# EAGLE design Tardis Lightv004 (EAGLE 6.1)
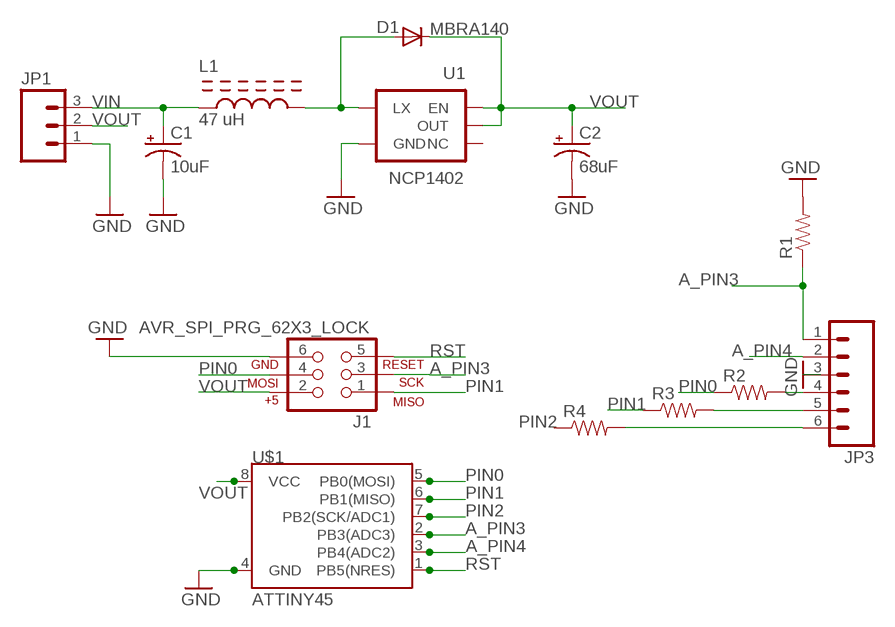
[diagram p0: schematic, sheet 1]

## Parts
C1  10uF  CAP_POL1206  [EIA3216]
C2  68uF  CAP_POL  [EIA2917]
D1  MBRA140  DIODESMA  [SMA-DIODE]
J1  AVR_SPI_PRG_62X3_LOCK  [2X3_LOCK]
JP1  M03PTH  [1X03]
JP3  M06SIP  [1X06]
L1  47 uH  SSR12606028  [NR6028]
R1  RESISTOR1206  [1206]
R2  RESISTOR1206  [1206]
R3  RESISTOR1206  [1206]
R4  RESISTOR1206  [1206]
U1  NCP1402  V_REG_NCP1400SOT23-5  [SOT23-5]
U$1  ATTINY45  [SO08-EIAJ]

## Nets
A_PIN3: J1.3 JP3.1 R1.1 U$1.2(PB3(ADC3))
A_PIN4: JP3.2 U$1.3(PB4(ADC2))
GND: C1.C(-) C2.C(-) J1.6 JP1.1 JP3.3 R1.2 U1.4(GND) U$1.4(GND)
N$1: JP3.4 R2.2
N$3: D1.A L1.P$2(P2) U1.5(LX)
N$6: JP3.5 R3.2
N$7: JP3.6 R4.2
PIN0: J1.4 R2.1 U$1.5(PB0(MOSI))
PIN1: J1.1 R3.1 U$1.6(PB1(MISO))
PIN2: R4.1 U$1.7(PB2(SCK/ADC1))
RST: J1.5 U$1.1(PB5(NRES))
VIN: C1.A(+) JP1.3 L1.P$1(P1)
VOUT: C2.A(+) D1.C J1.2 JP1.2 U1.1(EN) U1.2(OUT) U$1.8(VCC)
Unconnected: U1.3(NC)

## Library data of the parts
C1 C2 = SparkFun:CAP_POL: Capacitor Polarized These are standard SMD and PTH capacitors. Normally 10uF, 47uF, and 100uF in electrolytic and tantalum varieties. Always verify the external diameter of the through hole cap, it varies with capacity, voltage, and manufacturer. The EIA devices should be standard.
D1 = SparkFun:DIODE: Diode These are standard reverse protection diodes and small signal diodes. SMA package can handle up to about 1A. SOD-323 can handle about 200mA. What the SOD-323 package when ordering, there are some mfgs out there that are 5-pin packages.
J1 = SparkFun:AVR_SPI_PRG_6: AVR ISP 6 Pin This is the reduced ISP connector for AVR programming. Common on Arduino. This footprint will take up less PCB space and can be used with a 10-pin to 6-pin adapter such as SKU: BOB-08508
JP1 = SparkFun:M03: Header 3 Standard 3-pin 0.1" header. Use with straight break away headers (SKU : PRT-00116), right angle break away headers (PRT-00553), swiss pins (PRT-00743), machine pins (PRT-00117), and female headers (PRT-00115). Molex polarized connector foot print use with SKU : PRT-08232 with associated crimp pins and housings.
JP3 = SparkFun:M06: Header 6 Standard 6-pin 0.1" header. Use with straight break away headers (SKU : PRT-00116), right angle break away headers (PRT-00553), swiss pins (PRT-00743), machine pins (PRT-00117), and female headers (PRT-00115). Molex polarized connector foot print use with SKU : PRT-08094 with associated crimp pins and housings. NOTES ON THE VARIANTS LOCK and LOCK_LONGPADS... This footprint was designed to help hold the alignment of a through-hole component (i.e. 6-pin header) while soldering it into place. You may notice that each hole has been shifted either up or down by 0.005 of an inch from it's more standard position (which is a perfectly straight line). This slight alteration caused the pins (the squares in the middle) to touch the edges of the holes. Because they are alternating, it causes a "brace" to hold the component in place. 0.005 has proven to be the perfect amount of "off-center" position when using our standard breakaway headers. Although looks a little odd when you look at the bare footprint, once you have a header in there, the alteration is very hard to notice. Also, if you push a header all the way into place, it is covered up entirely on the bottom side. This idea of altering the position of holes to aid alignment will be further integrated into the Sparkfun Library for other footprints. It can help hold any component with 3 or more connection pins.
L1 = ieee-ucsd-lbr_inductor-bourns Roy Edit:SSR1260
R1-R4 = SparkFun:RESISTOR: Resistor Basic schematic elements and footprints for 0603, 1206, and PTH resistors.
U1 = SparkFun:V_REG_NCP1400: Switching step-up voltage regulator NCP1400 switiching regulator takes single cell AA and outputs 100mA at 3.3V or 5V with minimal number of external components.
U$1 = SparkFun:ATTINY45: Atmel ATTiny45

## Board
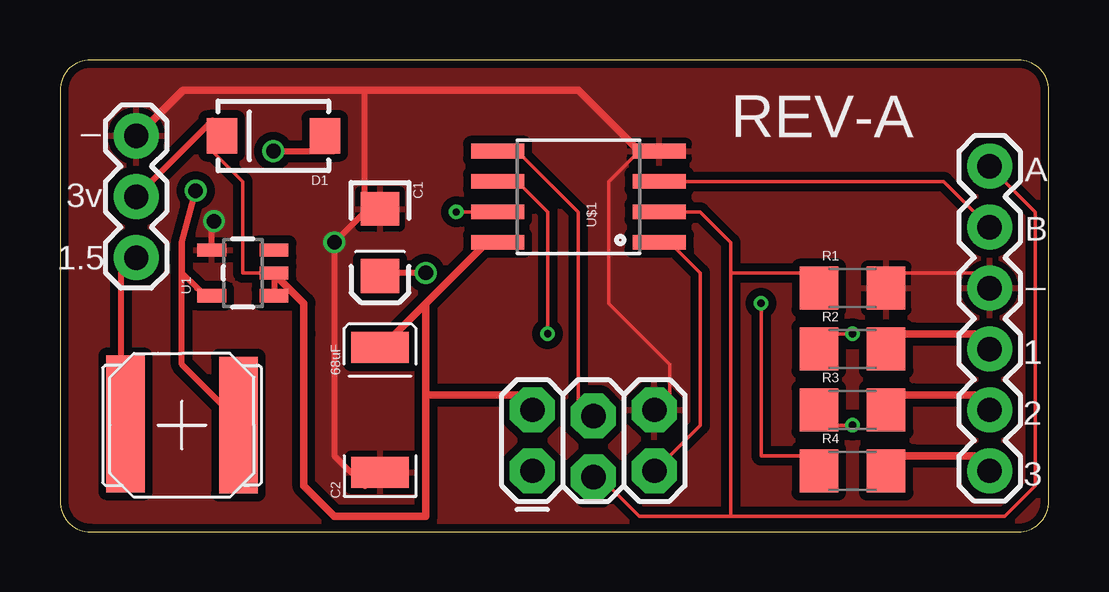
[diagram p1: board, top side]
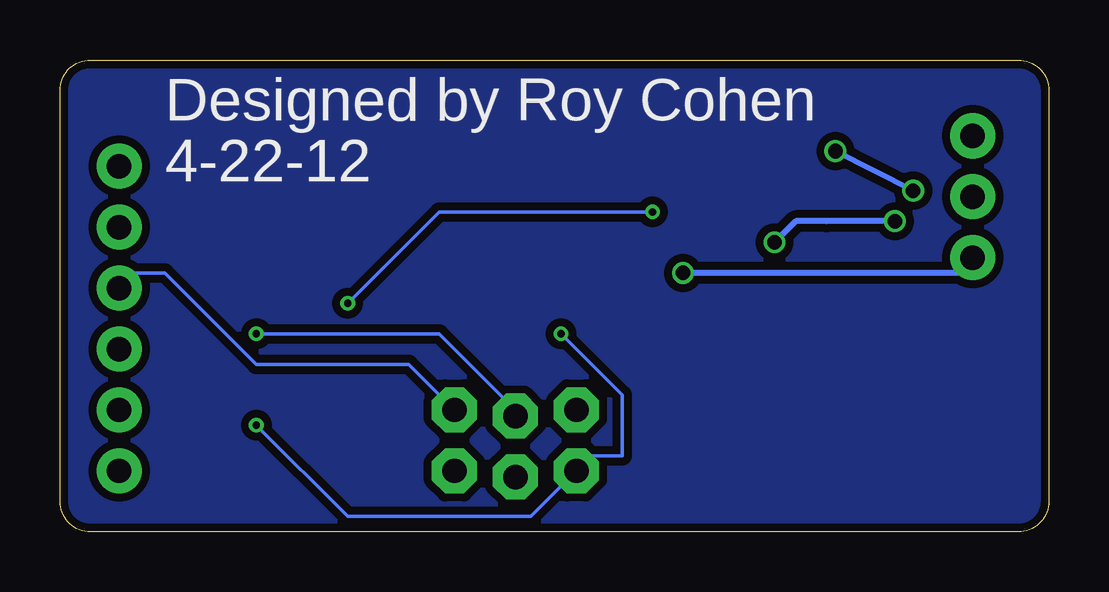
[diagram p2: board, bottom side, seen from below]

Size 41.2 x 19.68 mm. Coordinates in mm from the lower left corner, seen from the top.
Outline: 0,18.41 0,1.27 arc90 1.27,0 39.93,0 arc90 41.2,1.27 41.2,18.41 arc90 39.93,19.68 1.27,19.68 arc90 0,18.41
Copper layers (1*16): Top 0.035mm / dielectric 1.5mm / Bottom 0.035mm
Design rules: minimum track width 6mil, minimum drill 12mil, track to track 6mil, track to pad 6mil, pad to pad 6mil, via to via 6mil, smd to smd 0mil, copper to edge 10mil, drill to drill 10mil, minimum pad ring 10mil, minimum via ring 6mil, stop-mask expansion 2mil, vias tented up to drill 100mil, thermal gap 10mil

### Footprints (pad centres in the part's own frame; a part is rotated, then mirrored left to right if it is on the bottom)
EIA3216 = smd 1.4 x 1.6: A 1.4,0; C -1.4,0
EIA2917 = smd 1.3 x 2.4: A 2.6,0; C -2.6,0
SMA-DIODE = smd 1.27 x 1.47: A -2.15,0; C 2.15,0
2X3_LOCK = drill 1.016 pad 1.88 octagon: 1 0,0; 2 0,2.54; 3 2.54,-0.254; 4 2.54,2.286; 5 5.08,0; 6 5.08,2.54
1X03 = drill 1.016 pad 1.88: 1 0,0; 2 2.54,0; 3 5.08,0
1X06 = drill 1.016 pad 1.88: 1 0,0; 2 2.54,0; 3 5.08,0; 4 7.62,0; 5 10.16,0; 6 12.7,0
NR6028 = smd 5.7 x 1.6: P$1 -0.05,-2.35; P$2 0,2.35
1206 = smd 1.6 x 1.8: 1 -1.4,0; 2 1.4,0
SOT23-5 = smd 0.55 x 1.2: 1 -0.95,-1.3; 2 0,-1.3; 3 0.95,-1.3; 4 0.95,1.3; 5 -0.95,1.3
SO08-EIAJ = smd 0.61 x 2.21: 1 -1.905,-3.378; 2 -0.635,-3.378; 3 0.635,-3.378; 4 1.905,-3.378; 5 1.905,3.353; 6 0.635,3.353; 7 -0.635,3.353; 8 -1.905,3.353

### Placement (x,y rotation side)
C1  13.33,12.06 270 top
C2  13.33,5.08 90 top
D1  8.89,16.51 180 top
J1  19.68,2.54 0 top
JP1  3.17,16.51 270 top
JP3  38.74,15.24 270 top
L1  5.08,4.45 270 top
R1  33.02,10.16 0 top
R2  33.02,7.62 0 top
R3  33.02,5.08 0 top
R4  33.02,2.54 0 top
U1  7.62,10.79 90 top
U$1  21.59,13.97 90 top

### Tracks (layer width: path | path; a pad name or v marks a point on that pad's centre or on a via)
A_PIN3
  Top 0.152: 27.94,10.79 31.75,10.79 R1.1 | 27.94,10.79 27.94,12.06 26.67,13.33 25.4,13.33 U$1.2 | 27.94,0.64 24.13,0.64 22.86,1.91 J1.3 | 27.94,10.79 27.94,0.64 | 27.94,0.64 39.37,0.64 40.64,1.91 40.64,13.33 39.37,14.61 JP3.1
A_PIN4
  Top 0.152: U$1.3 25.4,14.61 36.83,14.61 38.1,13.33 JP3.2
GND  (via drill 0.6 pad 0.25)
  Top 0.152: 24.13,15.88 21.59,18.42 12.7,18.42 | 24.13,15.88 U$1.4 24.13,15.88 | R1.2 34.29,10.79 38.1,10.79 JP3.3 | 24.13,15.88 22.86,14.61 22.86,9.53 25.4,6.98 25.4,5.71 J1.6
  Top 0.254: 12.7,13.33 C1.C 12.7,13.33 | C2.C 12.7,1.91 11.43,3.17 v11.43,12.06 12.7,13.33 | 5.08,18.42 3.81,17.15 | 12.7,18.42 5.08,18.42 | 12.7,13.33 12.7,18.42 | 3.81,17.15 JP1.1 | v6.41,12.95 6.32,12.86 U1.4 | 12.7,18.42 5.08,18.42 | 5.08,18.42 3.81,17.15
  Top 0.305: 24.13,15.88 21.59,18.42 12.7,18.42 5.14,18.42 3.24,16.51
  Bottom 0.152: J1.6 25.4,5.71 26.67,6.98 33.02,6.98 36.83,10.79 38.1,10.79 JP3.3
  Bottom 0.254: v6.41,12.95 9.27,12.95 10.54,12.95 v11.43,12.06
  pour Top (isolate 0.33): 1.45,19.48 39.85,19.48 arc-90 40.92,18.42 40.92,1.17 arc-90 40.03,0.28 1.45,0.28 arc-90 0.2,1.52 0.2,18.24 arc-90
N$1
  Top 0.254: R2.2 34.29,8.26 35.56,8.26 38.1,8.26 JP3.4
  Top 0.305: JP3.4 38.1,8.26 35.56,8.26 34.93,8.26 34.86,8.19
N$3  (via drill 0.61)
  Top 0.254: v8.89,15.88 11.43,15.88 D1.A | 5.08,12.06 v5.65,14.22 | 5.08,10.79 5.08,6.98 7.62,4.45 L1.P$2 | 5.08,10.79 5.08,12.06 | 5.08,12.06 5.08,10.79 | 5.08,10.79 5.71,10.16 | 5.08,12.06 5.08,10.79 | 5.08,10.79 5.97,9.91 6.03,9.85 U1.5
  Bottom 0.254: v5.65,14.22 v8.89,15.88
N$4
  pour Bottom (isolate 0.33): 1.45,19.48 39.85,19.48 arc-90 40.92,18.42 40.92,1.17 arc-90 40.03,0.28 1.45,0.28 arc-90 0.2,1.52 0.2,18.24 arc-90
N$6
  Top 0.254: R3.2 34.29,5.71 35.05,5.71 35.56,5.71 38.1,5.71 JP3.5
  Top 0.305: 35.56,5.71 35.05,5.71 38.1,5.71 38.8,5.02
N$7
  Top 0.254: R4.2 34.29,3.17 35.12,3.17 35.56,3.17 38.1,3.17 JP3.6
  Top 0.305: 38.8,2.48 38.1,3.17 35.56,3.17 35.12,3.17
PIN0  (via drill 0.3)
  Top 0.152: v33.02,8.26 31.75,8.26 R2.1 | U$1.5 19.05,15.88 21.59,13.33 21.59,4.45 J1.4
  Bottom 0.152: v33.02,8.26 25.4,8.26 21.59,4.45 J1.4
PIN1  (via drill 0.3)
  Top 0.152: v33.02,4.45 31.75,4.45 R3.1 | v20.32,8.26 20.32,13.33 19.05,14.61 U$1.6
  Bottom 0.152: v33.02,4.45 29.21,0.64 21.59,0.64 20.32,1.91 J1.1 19.05,3.17 17.78,3.17 17.78,5.71 v20.32,8.26
PIN2  (via drill 0.3)
  Top 0.152: v29.21,9.53 29.21,3.17 31.75,3.17 R4.1 | v16.51,13.33 17.78,13.33 U$1.7
  Bottom 0.152: v29.21,9.53 25.4,13.33 v16.51,13.33
RST
  Top 0.152: U$1.1 25.4,12.06 26.67,10.79 26.67,4.45 25.4,3.17 J1.5
VIN  (via drill 0.61)
  Top 0.254: v15.24,10.79 13.97,10.79 C1.A | L1.P$1 2.54,5.71 2.54,10.79 JP1.3
  Bottom 0.254: v15.24,10.79 3.81,10.79 JP1.3
VOUT
  Top 0.152: 8.89,10.79 7.62,10.79 7.62,14.61 6.35,15.88 D1.C | 8.89,10.79 U1.2 8.89,10.79 | 15.24,9.53 13.97,8.26 C2.A | 15.24,9.53 17.78,12.06 U$1.8 | 10.16,1.91 10.16,8.26 | 12.7,0.64 15.24,0.64 15.24,5.71 | 15.24,9.53 15.24,5.71 | 15.24,5.71 19.05,5.71 J1.2
  Top 0.254: JP1.2 3.81,14.61 6.35,17.15 D1.C | U1.2 U1.1
  Top 0.305: 17.78,12.06 15.24,9.53 | 15.24,9.53 13.97,8.26 | 15.24,9.53 15.24,5.71 | 15.24,5.71 15.24,0.64 12.7,0.64 11.43,0.64 10.16,1.91 10.16,8.26 10.16,9.53 8.89,10.79 | 15.24,5.71 19.05,5.71 J1.2

### Text on the board
_tsilk: _ | REV-A | A | 3v | B | 1.5 | _ | 1 | 2 | 3
_bsilk: Designed by Roy Cohen | 4-22-12